# Altium schematic sheet USBPower.SchDoc
size A4; DocumentNumber: 4; SheetNumber: 4; SheetTotal: 4; RelSerie: X
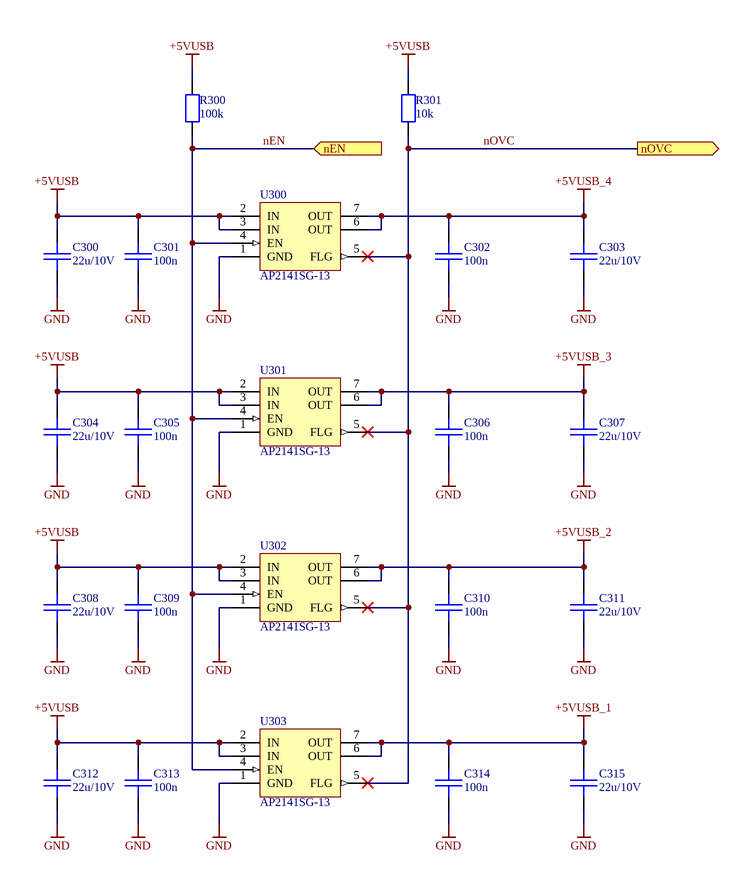
[diagram p0: USBPower.SchDoc]

## Parts
C300  22u/10V  [0805_C_E0]
C301  100n  [0603_C]
C302  100n  [0603_C]
C303  22u/10V  [0805_C_E0]
C304  22u/10V  [0805_C_E0]
C305  100n  [0603_C]
C306  100n  [0603_C]
C307  22u/10V  [0805_C_E0]
C308  22u/10V  [0805_C_E0]
C309  100n  [0603_C]
C310  100n  [0603_C]
C311  22u/10V  [0805_C_E0]
C312  22u/10V  [0805_C_E0]
C313  100n  [0603_C]
C314  100n  [0603_C]
C315  22u/10V  [0805_C_E0]
R300  100k  [0603_R]
R301  10k  [0603_R]
U300  AP2141SG-13  [SO8]
U301  AP2141SG-13  [SO8]
U302  AP2141SG-13  [SO8]
U303  AP2141SG-13  [SO8]

## Ports
nEN (in), nOVC (out)

## Nets
+5VUSB: C300.2 C301.2 C304.2 C305.2 C308.2 C309.2 C312.2 C313.2 R300.2 R301.2 U300.2(IN) U300.3(IN) U301.2(IN) U301.3(IN) U302.2(IN) U302.3(IN) U303.2(IN) U303.3(IN)
+5VUSB_1: C314.2 C315.2 U303.6(OUT) U303.7(OUT)
+5VUSB_2: C310.2 C311.2 U302.6(OUT) U302.7(OUT)
+5VUSB_3: C306.2 C307.2 U301.6(OUT) U301.7(OUT)
+5VUSB_4: C302.2 C303.2 U300.6(OUT) U300.7(OUT)
GND: C300.1 C301.1 C302.1 C303.1 C304.1 C305.1 C306.1 C307.1 C308.1 C309.1 C310.1 C311.1 C312.1 C313.1 C314.1 C315.1 U300.1(GND) U301.1(GND) U302.1(GND) U303.1(GND)
nEN: R300.1 U300.4(EN) U301.4(EN) U302.4(EN) U303.4(EN) ; port nEN
nOVC: R301.1 U300.5(FLG) U301.5(FLG) U302.5(FLG) U303.5(FLG) ; port nOVC

## Notes on the sheet
- Bezeichnung:
- Printnummer:
- Filename:
- Format:
- Blatt:
- Erstellt:
- Erst. Datum:
- Freigegeben:
- Serie
- Prototyp
- Entwicklung
- A4
- Nummer:
- Geprüft
- Geprüft Datum:
- Index:

## Library data of the parts
C300-C315 = C: Chip capacitor, generic
R300 R301 = R: Resistor, generic
U300-U303 = U_Q_AP2141SG-13: 0.5A SINGLE CHANNEL CURRENT-LIMITED POWERSWITCH SOIC8; Manufacturer: Diodes; Number of Outputs: 1; Current Rating: 800mA; Max Supply Voltage: 5.5V; Min Supply Voltage: 2.7V; Interface: On/Off; Max Output Current: 500mA; On-State Resistance: 95mR; Fault Protection: Over Temperature,Reverse Current; Output Configuration: High Side; ComponentLink1URL: https://datasheet.ciiva.com/15108/getdatasheetpartid-661768-15108858.pdf; ComponentLink1Description: https://datasheet.ciiva.com/15108/getdatasheetpartid-661768-15108858.pdf; ComponentLink2URL: https://datasheet.ciiva.com/26882/ap2141fmg-7-26882490.pdf; ComponentLink2Description: https://datasheet.ciiva.com/26882/ap2141fmg-7-26882490.pdf; ComponentLink3URL: https://datasheet.ciiva.com/1962/ap2141-51-1962188.pdf; ComponentLink3Description: https://datasheet.ciiva.com/1962/ap2141-51-1962188.pdf; ComponentLink4URL: https://datasheet.ciiva.com/1962/ap2141-51-1962189.pdf; ComponentLink4Description: https://datasheet.ciiva.com/1962/ap2141-51-1962189.pdf; ComponentLink5URL: https://datasheet.ciiva.com/1962/ap2141-51-1962190.pdf; ComponentLink5Description: https://datasheet.ciiva.com/1962/ap2141-51-1962190.pdf; Supplier 1: Digi-Key; Supplier Part Number 1: AP2141SGDICT-ND; Manufacturer Part Number: AP2141SG-13; RoHS: Yes; Stock 1: 5779; Pricing 1: 1 = 0.70000, 10 = 0.61200, 100 = 0.46910, 500 = 0.37080, 1000 = 0.29664 (USD); Mount: Surface Mount; Case/Package: SOP; Number of Pins: 8; Weight: 0.030018oz; Min Operating Temperature: -40°C; Max Operating Temperature: 85°C; Package Quantity: 2500; Packaging: Tape and Reel; Voltage: 5.5V; Current: 500mA; Length: 5.3mm; Height: 1.5mm; Width: 4.1mm; Radiation Hardening: No; REACH SVHC: No SVHC; Lead Free: Lead Free; ComponentLink6URL: http://www.farnell.com/datasheets/608802.pdf?src-supplier=Farnell; ComponentLink6Description: http://www.farnell.com/datasheets/608802.pdf?src-supplier=Farnell; ComponentLink7URL: http://www.farnell.com/datasheets/608802.pdf?src-supplier=Element14; ComponentLink7Description: http://www.farnell.com/datasheets/608802.pdf?src-supplier=Element14; ComponentLink8URL: http://www.diodes.com/datasheets/AP2141_51.pdf?src-supplier=Avnet; ComponentLink8Description: http://www.diodes.com/datasheets/AP2141_51.pdf?src-supplier=Avnet; ComponentLink9URL: https://www.verical.com/server-webapp/html/getDatasheet?partID=670762&src-supplier=Verical; ComponentLink9Description: https://www.verical.com/server-webapp/html/getDatasheet?partID=670762&src-supplier=Verical; ComponentLink10URL: http://www.farnell.com/datasheets/2238439.pdf?src-supplier=Element14; ComponentLink10Description: http://www.farnell.com/datasheets/2238439.pdf?src-supplier=Element14; ComponentLink11URL: http://www.diodes.com/datasheets/AP2141_51.pdf?src-supplier=Future+Electronics; ComponentLink11Description: http://www.diodes.com/datasheets/AP2141_51.pdf?src-supplier=Future+Electronics; ComponentLink12URL: https://www.diodes.com/assets/Datasheets/AP2141-51.pdf?src-supplier=Digi-Key; ComponentLink12Description: https://www.diodes.com/assets/Datasheets/AP2141-51.pdf?src-supplier=Digi-Key